# Altium project Xilinx_XCKU040_Ext_Board.PrjPcb
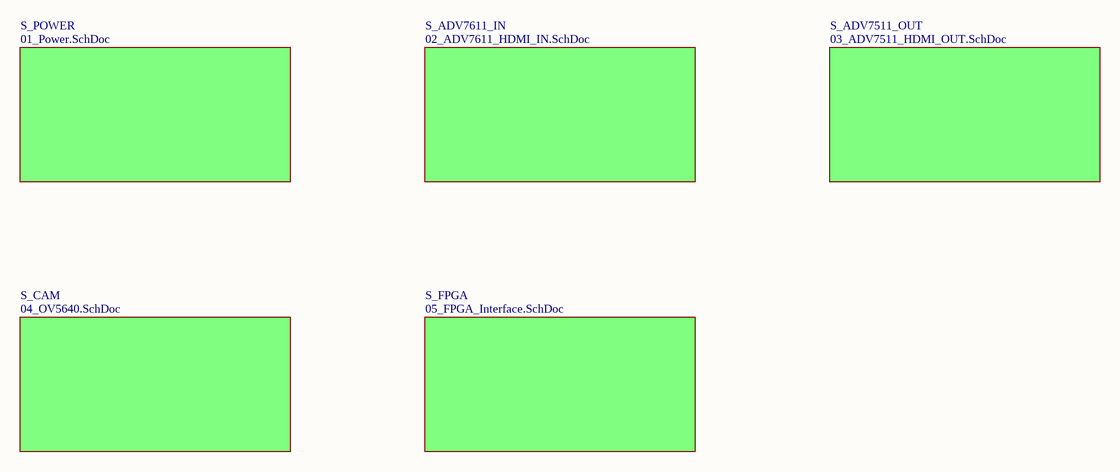
[diagram p0: 00_Top.SchDoc]
6 sheets, 134 parts. Net scope: global (net labels, ports and power ports of the same name join across sheets).
Board file: PCB1.PcbDoc
Sheets:
  00_Top.SchDoc
    S_POWER = 01_Power.SchDoc
    S_CAM = 04_OV5640.SchDoc
    S_FPGA = 05_FPGA_Interface.SchDoc
    S_ADV7611_IN = 02_ADV7611_HDMI_IN.SchDoc
    S_ADV7511_OUT = 03_ADV7511_HDMI_OUT.SchDoc

## Sheet 00_Top.SchDoc
size A3; SheetNumber: 1; SheetTotal: 6

### Sub-sheets
S_ADV7511_OUT = 03_ADV7511_HDMI_OUT.SchDoc: no entries
S_ADV7611_IN = 02_ADV7611_HDMI_IN.SchDoc: no entries
S_CAM = 04_OV5640.SchDoc: no entries
S_FPGA = 05_FPGA_Interface.SchDoc: no entries
S_POWER = 01_Power.SchDoc: no entries

## Sheet 01_Power.SchDoc
size A3; SheetNumber: 2; SheetTotal: 6
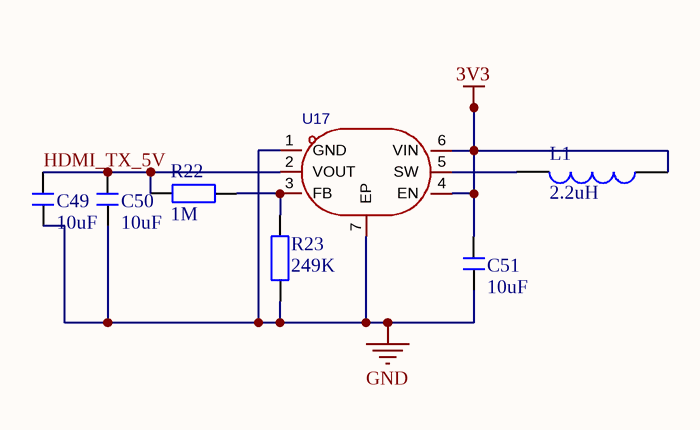
[diagram p1: 01_Power.SchDoc]

### Parts
C49  10uF  [C 0603_L]
C50  10uF  [C 0603_L]
C51  10uF  [C 0603_L]
L1  2.2uH  [L]
R22  1M  [R 0603_L]
R23  249K  [R 0603_L]
U17  tps61099drvr  [WSON-6_L2.0-W2.0-P0.65-TL-EP]  (value not drawn)

### Nets
3V3: C51.2 L1.1 U17.4(EN) U17.6(VIN)
GND: C49.1 C50.1 C51.1 R23.1 U17.1(GND) U17.7(EP)
HDMI_TX_5V: C49.2 C50.2 R22.1 U17.2(VOUT)
NetL1_2: L1.2 U17.5(SW)
NetR22_2: R22.2 R23.2 U17.3(FB)

### Library data of the parts
C49-C51 = C: 贴片电容; BOM名称: 无极性贴片电容; 淘宝ID: 封装库来自淘宝 ID：黄晶宝石; 联系售后: https://shop463601444.taobao.com
L1 = L: 小功率贴片电感; 淘宝ID: 封装库来自淘宝 ID：黄晶宝石; BOM名称: 小功率贴片电感; 联系售后: https://shop463601444.taobao.com
R22 R23 = R: 贴片电阻; 版权归属: 来自淘宝 ID：黄晶宝石; BOM名称: 贴片电阻; 联系售后: https://shop463601444.taobao.com
U17 = tps61099drvr: 功能类型:升压型;工作电压:700mV~5.5V;输出电压:1.8V~5.5V;输出电流:-;输出类型:可调;; Manufacturer: TI(德州仪器); AddInBom: yes; ModelId: 521c6d8f59ad4736925338f4a59f8ef4; ModelName: WSON-6_L2.0-W2.0-H0.8-P0.65; ModelTransform: 79.527,78.74,0,0,0,0,0,0,0; Function: 升压型; Synchronous Rectifier: 是; Number of Outputs: 1; Topology: 升压式; Quiescent Current: 1uA; Switch tube (built-in/external): 内置; Output Type: 可调; Symbol: TPS61099DRVR; LCSC Part Name: 升压型 700mV~5.5V; SupplierPart: C2842395; ManufacturerPart: TPS61099DRVR; Supplier Footprint: WSON-6-EP(2x2); JLCPCB Part Class: Extended Part; Datasheet: https://www.ti.com/cn/lit/gpn/tps61099; Supplier: LCSC; ConvertToPcb: yes; FootprintName: WSON-6_L2.0-W2.0-P0.65-TL-EP; Voltage - Supply: 700mV~5.5V; Output Voltage: 1.8V~5.5V; Output Current: -; Frequency - Switching: -; Operating Temperature: -40℃~+150℃@(TJ); Features: 轻载高效模式；逐波限流；过流保护；负载断开

## Sheet 04_OV5640.SchDoc
size A3; SheetNumber: 5; SheetTotal: 6
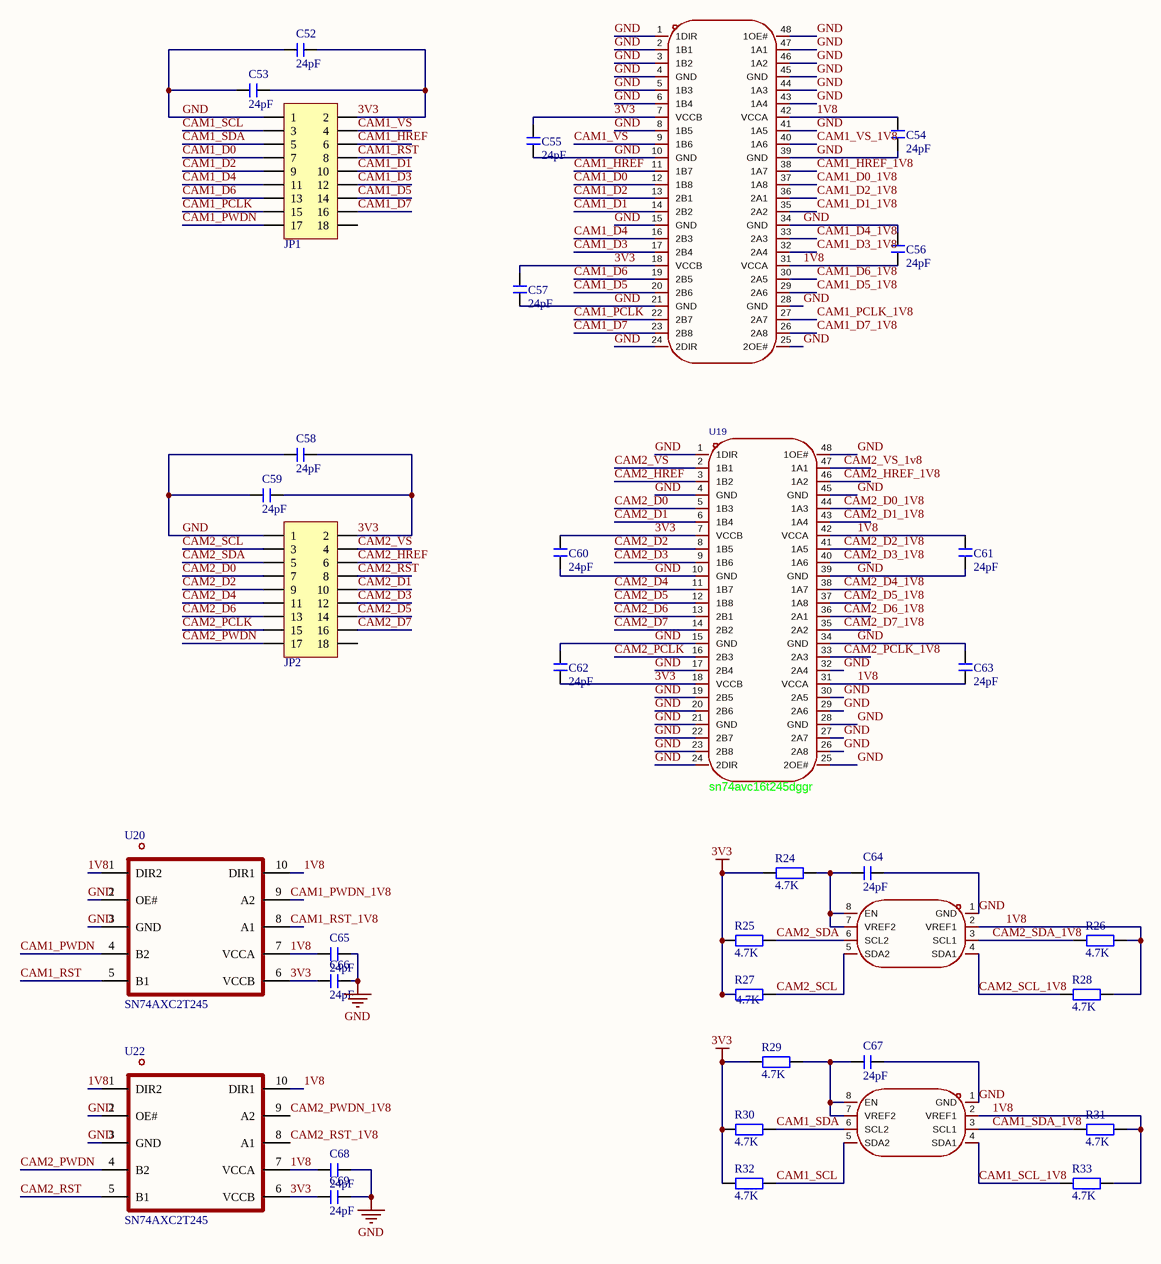
[diagram p2: 04_OV5640.SchDoc]

### Parts
C52  24pF  [C 0603_L]
C53  24pF  [C 0603_L]
C54  24pF  [C 0603_L]
C55  24pF  [C 0603_L]
C56  24pF  [C 0603_L]
C57  24pF  [C 0603_L]
C58  24pF  [C 0603_L]
C59  24pF  [C 0603_L]
C60  24pF  [C 0603_L]
C61  24pF  [C 0603_L]
C62  24pF  [C 0603_L]
C63  24pF  [C 0603_L]
C64  24pF  [C 0603_L]
C65  24pF  [C 0603_L]
C66  24pF  [C 0603_L]
C67  24pF  [C 0603_L]
C68  24pF  [C 0603_L]
C69  24pF  [C 0603_L]
JP1  Header 9X2  [HDR2.54-LI-2x9P]  (value not drawn)
JP2  Header 9X2  [HDR2.54-LI-2x9P]  (value not drawn)
R24  4.7K  [R 0603_L]
R25  4.7K  [R 0603_L]
R26  4.7K  [R 0603_L]
R27  4.7K  [R 0603_L]
R28  4.7K  [R 0603_L]
R29  4.7K  [R 0603_L]
R30  4.7K  [R 0603_L]
R31  4.7K  [R 0603_L]
R32  4.7K  [R 0603_L]
R33  4.7K  [R 0603_L]
U18  sn74avc16t245dggr  [TSSOP-48_L12.6-W6.2-P0.50-LS8.1-BL]  (value not drawn)
U19  sn74avc16t245dggr  [TSSOP-48_L12.6-W6.2-P0.50-LS8.1-BL]
U20  SN74AXC2T245  [SN74AXC2T245]
U21  pca9306dqer  [X2SON-8_L1.4-W1.0-P0.35-BL]  (value not drawn)
U22  SN74AXC2T245  [SN74AXC2T245]
U23  pca9306dqer  [X2SON-8_L1.4-W1.0-P0.35-BL]  (value not drawn)

### Nets
1V8: C54.1 C56.1 C61.1 C63.1 C65.1 C68.1 R26.1 R28.1 R31.1 R33.1 U18.31(VCCA) U18.42(VCCA) U19.31(VCCA) U19.42(VCCA) U20.1(DIR2) U20.7(VCCA) U20.10(DIR1) U21.2(VREF1) U22.1(DIR2) U22.7(VCCA) U22.10(DIR1) U23.2(VREF1)
3V3: C52.1 C53.2 C55.1 C57.1 C58.1 C59.2 C60.1 C62.2 C66.1 C69.1 JP1.2 JP2.2 R24.2 R25.2 R27.2 R29.2 R30.2 R32.2 U18.7(VCCB) U18.18(VCCB) U19.7(VCCB) U19.18(VCCB) U20.6(VCCB) U22.6(VCCB)
GND: C52.2 C53.1 C54.2 C55.2 C56.2 C57.2 C58.2 C59.1 C60.2 C61.2 C62.1 C63.2 C64.1 C65.2 C66.2 C67.1 C68.2 C69.2 JP1.1 JP2.1 U18.1(1DIR) U18.2(1B1) U18.3(1B2) U18.4(GND) U18.5(1B3) U18.6(1B4) U18.8(1B5) U18.10(GND) U18.15(GND) U18.21(GND) U18.24(2DIR) U18.25(2OE#) U18.28(GND) U18.34(GND) U18.39(GND) U18.41(1A5) U18.43(1A4) U18.44(1A3) U18.45(GND) U18.46(1A2) U18.47(1A1) U18.48(1OE#) U19.1(1DIR) U19.4(GND) U19.10(GND) U19.15(GND) U19.17(2B4) U19.19(2B5) U19.20(2B6) U19.21(GND) U19.22(2B7) U19.23(2B8) U19.24(2DIR) U19.25(2OE#) U19.26(2A8) U19.27(2A7) U19.28(GND) U19.29(2A6) U19.30(2A5) U19.32(2A4) U19.34(GND) U19.39(GND) U19.45(GND) U19.48(1OE#) U20.2(OE#) U20.3(GND) U21.1(GND) U22.2(OE#) U22.3(GND) U23.1(GND)
CAM1_D0: JP1.7 U18.12(1B8)
CAM1_D0_1V8: U18.37(1A8)
CAM1_D1: JP1.10 U18.14(2B2)
CAM1_D1_1V8: U18.35(2A2)
CAM1_D2: JP1.9 U18.13(2B1)
CAM1_D2_1V8: U18.36(2A1)
CAM1_D3: JP1.12 U18.17(2B4)
CAM1_D3_1V8: U18.32(2A4)
CAM1_D4: JP1.11 U18.16(2B3)
CAM1_D4_1V8: U18.33(2A3)
CAM1_D5: JP1.14 U18.20(2B6)
CAM1_D5_1V8: U18.29(2A6)
CAM1_D6: JP1.13 U18.19(2B5)
CAM1_D6_1V8: U18.30(2A5)
CAM1_D7: JP1.16 U18.23(2B8)
CAM1_D7_1V8: U18.26(2A8)
CAM1_HREF: JP1.6 U18.11(1B7)
CAM1_HREF_1V8: U18.38(1A7)
CAM1_PCLK: JP1.15 U18.22(2B7)
CAM1_PCLK_1V8: U18.27(2A7)
CAM1_PWDN: JP1.17 U20.4(B2)
CAM1_PWDN_1V8: U20.9(A2)
CAM1_RST: JP1.8 U20.5(B1)
CAM1_RST_1V8: U20.8(A1)
CAM1_SCL: JP1.3 R32.1 U23.5(SDA2)
CAM1_SCL_1V8: R33.2 U23.4(SDA1)
CAM1_SDA: JP1.5 R30.1 U23.6(SCL2)
CAM1_SDA_1V8: R31.2 U23.3(SCL1)
CAM1_VS: JP1.4 U18.9(1B6)
CAM1_VS_1V8: U18.40(1A6)
CAM2_D0: JP2.7 U19.5(1B3)
CAM2_D0_1V8: U19.44(1A3)
CAM2_D1: JP2.10 U19.6(1B4)
CAM2_D1_1V8: U19.43(1A4)
CAM2_D2: JP2.9 U19.8(1B5)
CAM2_D2_1V8: U19.41(1A5)
CAM2_D3: JP2.12 U19.9(1B6)
CAM2_D3_1V8: U19.40(1A6)
CAM2_D4: JP2.11 U19.11(1B7)
CAM2_D4_1V8: U19.38(1A7)
CAM2_D5: JP2.14 U19.12(1B8)
CAM2_D5_1V8: U19.37(1A8)
CAM2_D6: JP2.13 U19.13(2B1)
CAM2_D6_1V8: U19.36(2A1)
CAM2_D7: JP2.16 U19.14(2B2)
CAM2_D7_1V8: U19.35(2A2)
CAM2_HREF: JP2.6 U19.3(1B2)
CAM2_HREF_1V8: U19.46(1A2)
CAM2_PCLK: JP2.15 U19.16(2B3)
CAM2_PCLK_1V8: U19.33(2A3)
CAM2_PWDN: JP2.17 U22.4(B2)
CAM2_PWDN_1V8: U22.9(A2)
CAM2_RST: JP2.8 U22.5(B1)
CAM2_RST_1V8: U22.8(A1)
CAM2_SCL: JP2.3 R27.1 U21.5(SDA2)
CAM2_SCL_1V8: R28.2 U21.4(SDA1)
CAM2_SDA: JP2.5 R25.1 U21.6(SCL2)
CAM2_SDA_1V8: R26.2 U21.3(SCL1)
CAM2_VS: JP2.4 U19.2(1B1)
CAM2_VS_1v8: U19.47(1A1)
NetC64_2: C64.2 R24.1 U21.7(VREF2) U21.8(EN)
NetC67_2: C67.2 R29.1 U23.7(VREF2) U23.8(EN)

Not connected (* = marked no-connect by the designer): JP1 18; JP2 18

### Library data of the parts
C52-C69 = C: as C49 on sheet 01_Power; 联系售后: https://shop463601444.taobao.com
JP1 JP2 = Header 9X2: 9*2P接插件; 版权归属: 源创客; BOM名称: 9*2P接插件; 学习资源: www.ooocke.com
R24-R33 = R: 贴片电阻; 版权归属: 来自淘宝 ID：黄晶宝石; BOM名称: 贴片电阻; 联系售后: https://shop463601444.taobao.com
U18 U19 = sn74avc16t245dggr: SN74AVC16T245 具有可配置电压转换和三态输出的 16 位双电源总线收发器; Manufacturer: TI(德州仪器); AddInBom: yes; ModelId: 3630bc8bc65c4ae4913ce685d85b0283; ModelName: TSSOP-48_L12.6-W6.1-H1.0-LS8.1-P0.50; ModelTransform: 318.898,496.063,0,90,0,0,0,0.0045,0; Symbol: SN74AVC16T245DGGR; LCSC Part Name: 具备可配置电平转换/电压转换功能和三态输出的16位双电源总线收发器; SupplierPart: C148481; ManufacturerPart: SN74AVC16T245DGGR; Supplier Footprint: TSSOP-48-6.2mm; JLCPCB Part Class: Extended Part; Datasheet: https://www.ti.com/cn/lit/gpn/sn74avc16t245; Supplier: LCSC; ConvertToPcb: yes; FootprintName: TSSOP-48_L12.6-W6.2-P0.50-LS8.1-BL
U21 U23 = pca9306dqer: 数据速率:-;工作电压(VCCA):-;工作电压(VCCB):-;元件数:-;每个电路通道数:2;; Manufacturer: TI(德州仪器); AddInBom: yes; ModelId: ca9e004a924f4dd0ba6981db82d16128; ModelName: X2SON-8_L1.4-W1.0-H0.4-P0.35-BL; ModelTransform: 55.118,40.05354,0,180,0,0,0.003,0.603,0; Channel Type: 双向; Number of Circuits: 2; Output Type: 开漏; Symbol: PCA9306DQER; LCSC Part Name: 双路双向I²C总线和SMBus电压电平转换器; SupplierPart: C440032; ManufacturerPart: PCA9306DQER; Supplier Footprint: X2-SON-8(0.8x1.4); JLCPCB Part Class: Extended Part; Datasheet: https://www.ti.com/cn/lit/gpn/pca9306; Supplier: LCSC; ConvertToPcb: yes; FootprintName: X2SON-8_L1.4-W1.0-P0.35-BL; Input Signal: -; Output Signal: -; Data Rate: -; Voltage - Supply(VCCA): -; Voltage - Supply(VCCB): -; Number of Elements: -; Operating Temperature: -40℃~+85℃; Features: -

## Sheet 05_FPGA_Interface.SchDoc
size A3; SheetNumber: 6; SheetTotal: 6
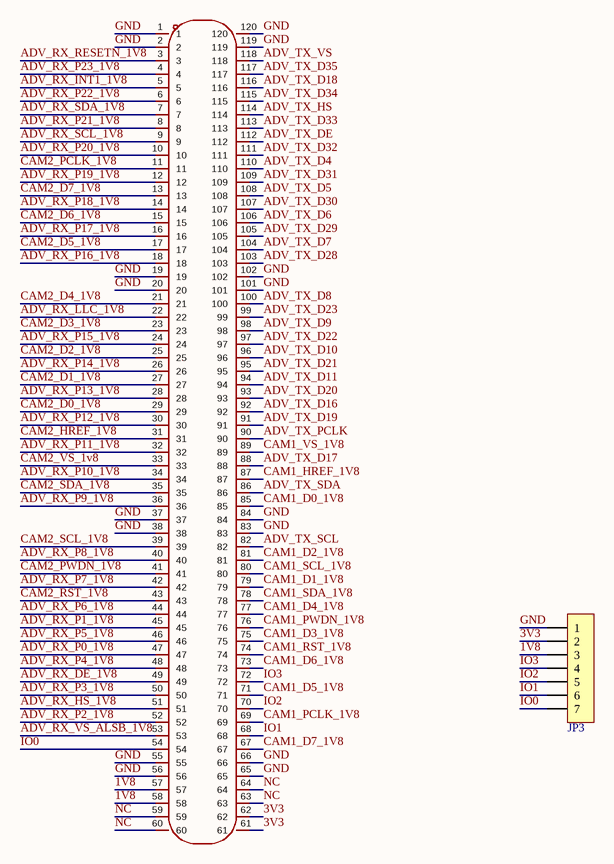
[diagram p3: 05_FPGA_Interface.SchDoc]

### Parts
CN1  xdb612-120p-cor  [CONN-SMD_120P-P0.80_THD0812F-120BV-GF]  (value not drawn)
JP3  HDR-1X7  [HDR2.54-LI-7P]  (value not drawn)

### Nets
1V8: CN1.57 CN1.58 JP3.3
3V3: CN1.61 CN1.62 JP3.2
GND: CN1.1 CN1.2 CN1.19 CN1.20 CN1.37 CN1.38 CN1.55 CN1.56 CN1.65 CN1.66 CN1.83 CN1.84 CN1.101 CN1.102 CN1.119 CN1.120 JP3.1
ADV_RX_DE_1V8: CN1.49
ADV_RX_HS_1V8: CN1.51
ADV_RX_INT1_1V8: CN1.5
ADV_RX_LLC_1V8: CN1.22
ADV_RX_P0_1V8: CN1.47
ADV_RX_P1_1V8: CN1.45
ADV_RX_P2_1V8: CN1.52
ADV_RX_P3_1V8: CN1.50
ADV_RX_P4_1V8: CN1.48
ADV_RX_P5_1V8: CN1.46
ADV_RX_P6_1V8: CN1.44
ADV_RX_P7_1V8: CN1.42
ADV_RX_P8_1V8: CN1.40
ADV_RX_P9_1V8: CN1.36
ADV_RX_P10_1V8: CN1.34
ADV_RX_P11_1V8: CN1.32
ADV_RX_P12_1V8: CN1.30
ADV_RX_P13_1V8: CN1.28
ADV_RX_P14_1V8: CN1.26
ADV_RX_P15_1V8: CN1.24
ADV_RX_P16_1V8: CN1.18
ADV_RX_P17_1V8: CN1.16
ADV_RX_P18_1V8: CN1.14
ADV_RX_P19_1V8: CN1.12
ADV_RX_P20_1V8: CN1.10
ADV_RX_P21_1V8: CN1.8
ADV_RX_P22_1V8: CN1.6
ADV_RX_P23_1V8: CN1.4
ADV_RX_RESETN_1V8: CN1.3
ADV_RX_SCL_1V8: CN1.9
ADV_RX_SDA_1V8: CN1.7
ADV_RX_VS_ALSB_1V8: CN1.53
ADV_TX_D4: CN1.110
ADV_TX_D5: CN1.108
ADV_TX_D6: CN1.106
ADV_TX_D7: CN1.104
ADV_TX_D8: CN1.100
ADV_TX_D9: CN1.98
ADV_TX_D10: CN1.96
ADV_TX_D11: CN1.94
ADV_TX_D16: CN1.92
ADV_TX_D17: CN1.88
ADV_TX_D18: CN1.116
ADV_TX_D19: CN1.91
ADV_TX_D20: CN1.93
ADV_TX_D21: CN1.95
ADV_TX_D22: CN1.97
ADV_TX_D23: CN1.99
ADV_TX_D28: CN1.103
ADV_TX_D29: CN1.105
ADV_TX_D30: CN1.107
ADV_TX_D31: CN1.109
ADV_TX_D32: CN1.111
ADV_TX_D33: CN1.113
ADV_TX_D34: CN1.115
ADV_TX_D35: CN1.117
ADV_TX_DE: CN1.112
ADV_TX_HS: CN1.114
ADV_TX_PCLK: CN1.90
ADV_TX_SCL: CN1.82
ADV_TX_SDA: CN1.86
ADV_TX_VS: CN1.118
CAM1_D0_1V8: CN1.85
CAM1_D1_1V8: CN1.79
CAM1_D2_1V8: CN1.81
CAM1_D3_1V8: CN1.75
CAM1_D4_1V8: CN1.77
CAM1_D5_1V8: CN1.71
CAM1_D6_1V8: CN1.73
CAM1_D7_1V8: CN1.67
CAM1_HREF_1V8: CN1.87
CAM1_PCLK_1V8: CN1.69
CAM1_PWDN_1V8: CN1.76
CAM1_RST_1V8: CN1.74
CAM1_SCL_1V8: CN1.80
CAM1_SDA_1V8: CN1.78
CAM1_VS_1V8: CN1.89
CAM2_D0_1V8: CN1.29
CAM2_D1_1V8: CN1.27
CAM2_D2_1V8: CN1.25
CAM2_D3_1V8: CN1.23
CAM2_D4_1V8: CN1.21
CAM2_D5_1V8: CN1.17
CAM2_D6_1V8: CN1.15
CAM2_D7_1V8: CN1.13
CAM2_HREF_1V8: CN1.31
CAM2_PCLK_1V8: CN1.11
CAM2_PWDN_1V8: CN1.41
CAM2_RST_1V8: CN1.43
CAM2_SCL_1V8: CN1.39
CAM2_SDA_1V8: CN1.35
CAM2_VS_1v8: CN1.33
IO0: CN1.54 JP3.7
IO1: CN1.68 JP3.6
IO2: CN1.70 JP3.5
IO3: CN1.72 JP3.4
NC: CN1.59 CN1.60 CN1.63 CN1.64

### Library data of the parts
CN1 = xdb612-120p-cor: PIN总数:120P;间距:0.8mm;安装方式:立贴;排数:2;额定电流:500mA;工作温度:-45℃~+80℃;; Manufacturer: LX(连欣科技); AddInBom: yes; ModelId: 534587499f204ed784a0d3d633a8bbcf; ModelTransform: 2118.10616,236.22,0,0,0,0,0.002,0,-27.559; Pitch: 0.8mm; Current Rating: 500mA; Symbol: XDB612-120P-COR; LCSC Part Name: AMP宏致同款BTB板对板PH0.8-2*60P/120PIN母座 合高5.0MM; SupplierPart: C7527742; ManufacturerPart: XDB612-120P-COR; Supplier Footprint: SMD,P=0.8mm; JLCPCB Part Class: Extended Part; Datasheet: https://item.szlcsc.com/datasheet/XDB612-120P-COR/8623463.html; Supplier: LCSC; ConvertToPcb: yes; FootprintName: CONN-SMD_120P-P0.80_THD0812F-120BV-GF; ModelName: CONN-SMD_120P-P0.80_THD0812F-120BV-GF; Number of Pins: 120P; Mounting Type: 立贴; Number of Rows: 2; Contact Material: 铜; Contact Plating: 金; Operating Temperature: -45℃~+80℃
JP3 = Header 7: 7P接插件; 版权归属: 封装库来自淘宝 ID：黄晶宝石; BOM名称: 7P接插件; 学习资源: https://shop463601444.taobao.com

## Sheet 02_ADV7611_HDMI_IN.SchDoc
size A3; SheetNumber: 3; SheetTotal: 6
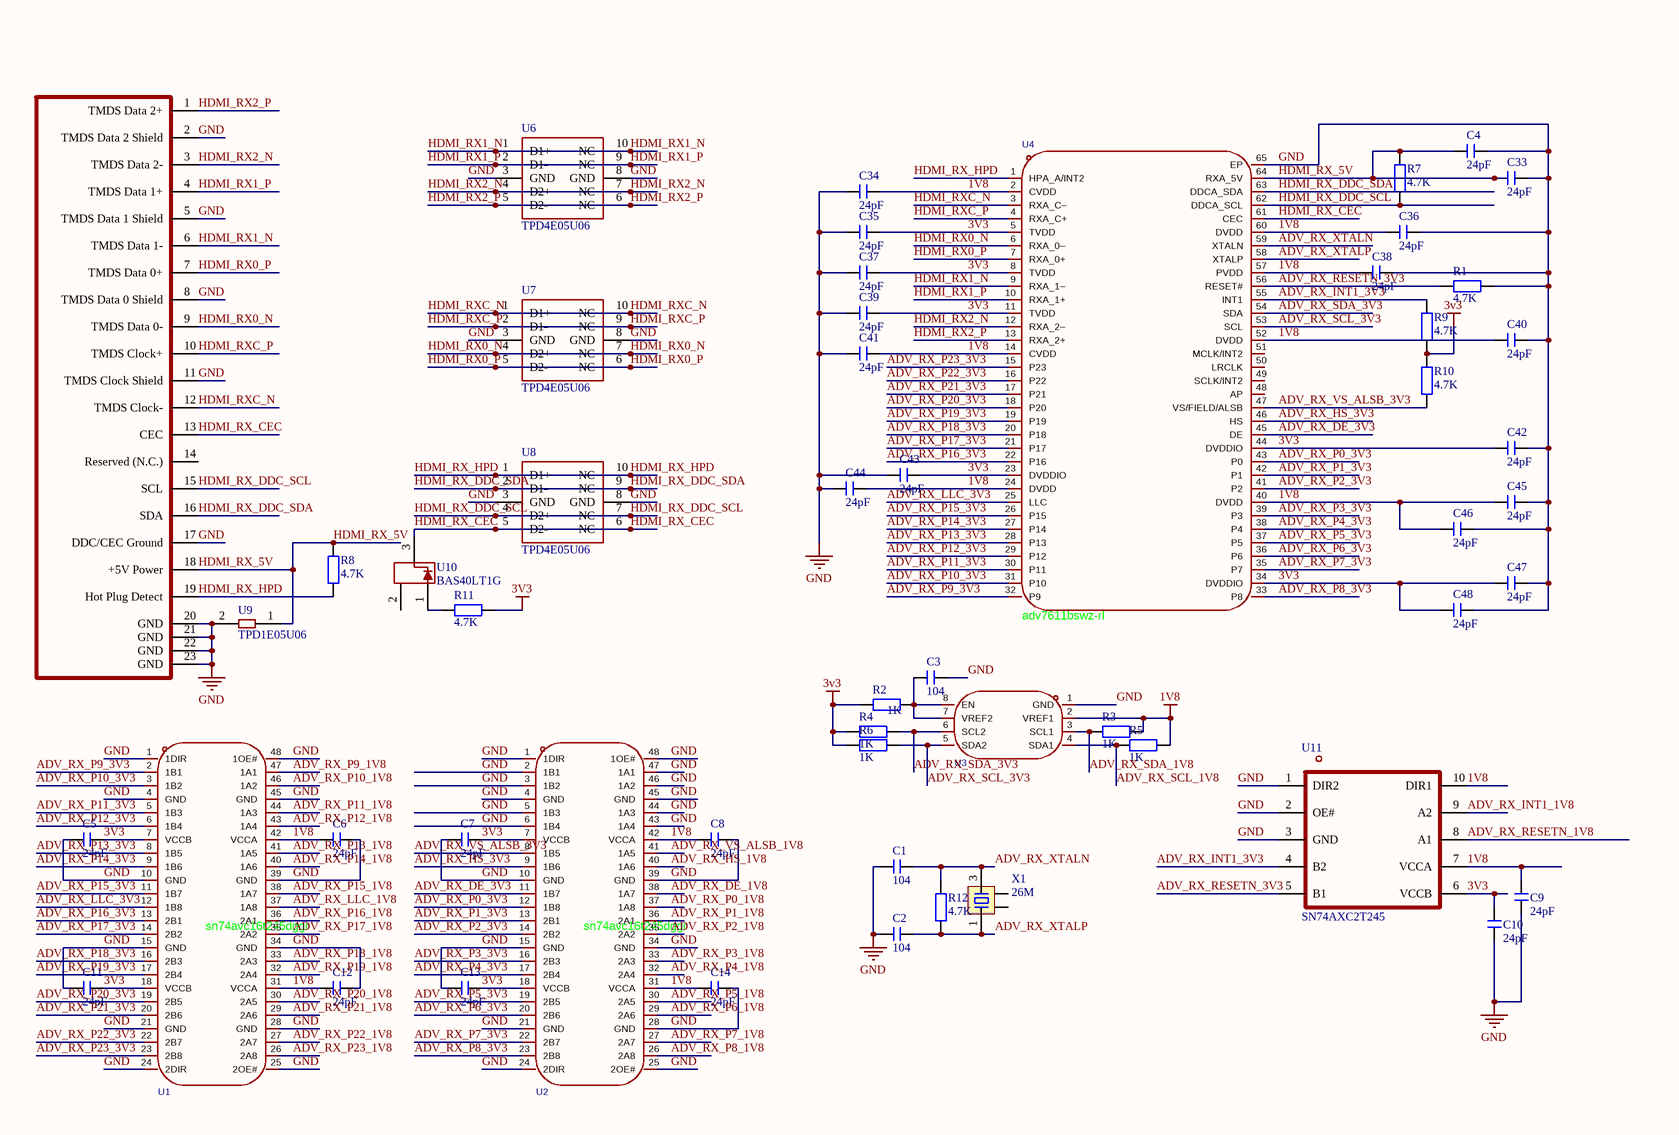
[diagram p4: 02_ADV7611_HDMI_IN.SchDoc, left]

### Parts
C1  104  [C 0603_L]
C2  104  [C 0603_L]
C3  104  [C 0603_L]
C4  24pF  [C 0603_L]
C5  24pF  [C 0603_L]
C6  24pF  [C 0603_L]
C7  24pF  [C 0603_L]
C8  24pF  [C 0603_L]
C9  24pF  [C 0603_L]
C10  24pF  [C 0603_L]
C11  24pF  [C 0603_L]
C12  24pF  [C 0603_L]
C13  24pF  [C 0603_L]
C14  24pF  [C 0603_L]
C33  24pF  [C 0603_L]
C34  24pF  [C 0603_L]
C35  24pF  [C 0603_L]
C36  24pF  [C 0603_L]
C37  24pF  [C 0603_L]
C38  24pF  [C 0603_L]
C39  24pF  [C 0603_L]
C40  24pF  [C 0603_L]
C41  24pF  [C 0603_L]
C42  24pF  [C 0603_L]
C43  24pF  [C 0603_L]
C44  24pF  [C 0603_L]
C45  24pF  [C 0603_L]
C46  24pF  [C 0603_L]
C47  24pF  [C 0603_L]
C48  24pF  [C 0603_L]
R1  4.7K  [R 0603_L]
R2  1K  [R 0603_L]
R3  1K  [R 0603_L]
R4  1K  [R 0603_L]
R5  1K  [R 0603_L]
R6  1K  [R 0603_L]
R7  4.7K  [R 0603_L]
R8  4.7K  [R 0603_L]
R9  4.7K  [R 0603_L]
R10  4.7K  [R 0603_L]
R11  4.7K  [R 0603_L]
R12  4.7K  [R 0603_L]
U1  sn74avc16t245dggr  [TSSOP-48_L12.6-W6.2-P0.50-LS8.1-BL]
U2  sn74avc16t245dggr  [TSSOP-48_L12.6-W6.2-P0.50-LS8.1-BL]
U3  pca9306dqer  [X2SON-8_L1.4-W1.0-P0.35-BL]  (value not drawn)
U4  adv7611bswz-rl  [LQFP-64_L10.0-W10.0-P0.50-LS12.0-TL-EP5.3]
U6  TPD4E05U06  [TPD4E05U06DQAR]
U7  TPD4E05U06  [TPD4E05U06DQAR]
U8  TPD4E05U06  [TPD4E05U06DQAR]
U9  TPD1E05U06  [TPD1E05U06]
U10  BAS40LT1G  [BAS40LT1G]
U11  SN74AXC2T245  [SN74AXC2T245]
USB1  hdmi-001s  [HDMI-SMD_HDMI-001S]  (value not drawn)
X1  26M  [OSC 1612-4P]

### Nets
1V8: C6.1 C8.1 C9.2 C12.1 C14.1 C34.2 C36.1 C38.1 C40.1 C41.2 C44.2 C45.1 C46.1 R3.2 R5.2 U1.31(VCCA) U1.42(VCCA) U2.31(VCCA) U2.42(VCCA) U3.2(VREF1) U4.2(CVDD) U4.14(CVDD) U4.24(DVDD) U4.40(DVDD) U4.52(DVDD) U4.57(PVDD) U4.60(DVDD) U11.7(VCCA) U11.10(DIR1)
3V3: C5.2 C7.2 C10.2 C11.2 C13.2 C35.2 C37.2 C39.2 C42.1 C43.2 C47.1 C48.1 R2.2 R4.1 R6.1 R9.2 R10.1 R11.2 U1.7(VCCB) U1.18(VCCB) U2.7(VCCB) U2.18(VCCB) U4.5(TVDD) U4.8(TVDD) U4.11(TVDD) U4.23(DVDDIO) U4.34(DVDDIO) U4.44(DVDDIO) U11.6(VCCB)
GND: C1.1 C2.1 C3.2 C4.2 C5.1 C6.2 C7.1 C8.2 C9.1 C10.1 C11.1 C12.2 C13.1 C14.2 C33.2 C34.1 C35.1 C36.2 C37.1 C38.2 C39.1 C40.2 C41.1 C42.2 C43.1 C44.1 C45.2 C46.2 C47.2 C48.2 R1.2 U1.1(1DIR) U1.4(GND) U1.10(GND) U1.15(GND) U1.21(GND) U1.24(2DIR) U1.25(2OE#) U1.28(GND) U1.34(GND) U1.39(GND) U1.45(GND) U1.48(1OE#) U2.1(1DIR) U2.2(1B1) U2.3(1B2) U2.4(GND) U2.5(1B3) U2.6(1B4) U2.10(GND) U2.15(GND) U2.21(GND) U2.24(2DIR) U2.25(2OE#) U2.28(GND) U2.34(GND) U2.39(GND) U2.43(1A4) U2.44(1A3) U2.45(GND) U2.46(1A2) U2.47(1A1) U2.48(1OE#) U3.1(GND) U4.65(EP) U6.3(GND) U6.8(GND) U7.3(GND) U7.8(GND) U8.3(GND) U8.8(GND) U9.2(GND) U11.1(DIR2) U11.2(OE#) U11.3(GND) USB1.2(TMDS_Data_2_Shield) USB1.5(TMDS_Data_1_Shield) USB1.8(TMDS_Data_0_Shield) USB1.11(TMDS_Clock_Shield) USB1.17(DDC/CEC_Ground) USB1.20(GND) USB1.21(GND) USB1.22(GND) USB1.23(GND)
ADV_RX_DE_1V8: U2.38(1A7)
ADV_RX_DE_3V3: U2.11(1B7) U4.45(DE)
ADV_RX_HS_1V8: U2.40(1A6)
ADV_RX_HS_3V3: U2.9(1B6) U4.46(HS)
ADV_RX_INT1_1V8: U11.9(A2)
ADV_RX_INT1_3V3: R9.1 U4.55(INT1) U11.4(B2)
ADV_RX_LLC_1V8: U1.37(1A8)
ADV_RX_LLC_3V3: U1.12(1B8) U4.25(LLC)
ADV_RX_P0_1V8: U2.37(1A8)
ADV_RX_P0_3V3: U2.12(1B8) U4.43(P0)
ADV_RX_P1_1V8: U2.36(2A1)
ADV_RX_P1_3V3: U2.13(2B1) U4.42(P1)
ADV_RX_P2_1V8: U2.35(2A2)
ADV_RX_P2_3V3: U2.14(2B2) U4.41(P2)
ADV_RX_P3_1V8: U2.33(2A3)
ADV_RX_P3_3V3: U2.16(2B3) U4.39(P3)
ADV_RX_P4_1V8: U2.32(2A4)
ADV_RX_P4_3V3: U2.17(2B4) U4.38(P4)
ADV_RX_P5_1V8: U2.30(2A5)
ADV_RX_P5_3V3: U2.19(2B5) U4.37(P5)
ADV_RX_P6_1V8: U2.29(2A6)
ADV_RX_P6_3V3: U2.20(2B6) U4.36(P6)
ADV_RX_P7_1V8: U2.27(2A7)
ADV_RX_P7_3V3: U2.22(2B7) U4.35(P7)
ADV_RX_P8_1V8: U2.26(2A8)
ADV_RX_P8_3V3: U2.23(2B8) U4.33(P8)
ADV_RX_P9_1V8: U1.47(1A1)
ADV_RX_P9_3V3: U1.2(1B1) U4.32(P9)
ADV_RX_P10_1V8: U1.46(1A2)
ADV_RX_P10_3V3: U1.3(1B2) U4.31(P10)
ADV_RX_P11_1V8: U1.44(1A3)
ADV_RX_P11_3V3: U1.5(1B3) U4.30(P11)
ADV_RX_P12_1V8: U1.43(1A4)
ADV_RX_P12_3V3: U1.6(1B4) U4.29(P12)
ADV_RX_P13_1V8: U1.41(1A5)
ADV_RX_P13_3V3: U1.8(1B5) U4.28(P13)
ADV_RX_P14_1V8: U1.40(1A6)
ADV_RX_P14_3V3: U1.9(1B6) U4.27(P14)
ADV_RX_P15_1V8: U1.38(1A7)
ADV_RX_P15_3V3: U1.11(1B7) U4.26(P15)
ADV_RX_P16_1V8: U1.36(2A1)
ADV_RX_P16_3V3: U1.13(2B1) U4.22(P16)
ADV_RX_P17_1V8: U1.35(2A2)
ADV_RX_P17_3V3: U1.14(2B2) U4.21(P17)
ADV_RX_P18_1V8: U1.33(2A3)
ADV_RX_P18_3V3: U1.16(2B3) U4.20(P18)
ADV_RX_P19_1V8: U1.32(2A4)
ADV_RX_P19_3V3: U1.17(2B4) U4.19(P19)
ADV_RX_P20_1V8: U1.30(2A5)
ADV_RX_P20_3V3: U1.19(2B5) U4.18(P20)
ADV_RX_P21_1V8: U1.29(2A6)
ADV_RX_P21_3V3: U1.20(2B6) U4.17(P21)
ADV_RX_P22_1V8: U1.27(2A7)
ADV_RX_P22_3V3: U1.22(2B7) U4.16(P22)
ADV_RX_P23_1V8: U1.26(2A8)
ADV_RX_P23_3V3: U1.23(2B8) U4.15(P23)
ADV_RX_RESETN_1V8: U11.8(A1)
ADV_RX_RESETN_3V3: R1.1 U4.56(RESET#) U11.5(B1)
ADV_RX_SCL_1V8: R5.1 U3.4(SDA1)
ADV_RX_SCL_3V3: R6.2 U3.5(SDA2) U4.53(SCL)
ADV_RX_SDA_1V8: R3.1 U3.3(SCL1)
ADV_RX_SDA_3V3: R4.2 U3.6(SCL2) U4.54(SDA)
ADV_RX_VS_ALSB_1V8: U2.41(1A5)
ADV_RX_VS_ALSB_3V3: R10.2 U2.8(1B5) U4.47(VS/FIELD/ALSB)
ADV_RX_XTALN: C1.2 R12.2 U4.59(XTALN) X1.3
ADV_RX_XTALP: C2.2 R12.1 U4.58(XTALP) X1.1
HDMI_RX0_N: U4.6(RXA_0–) U7.4(D2+) U7.7(NC) USB1.9(TMDS_Data_0-)
HDMI_RX0_P: U4.7(RXA_0+) U7.5(D2-) U7.6(NC) USB1.7(TMDS_Data_0+)
HDMI_RX1_N: U4.9(RXA_1–) U6.1(D1+) U6.10(NC) USB1.6(TMDS_Data_1-)
HDMI_RX1_P: U4.10(RXA_1+) U6.2(D1-) U6.9(NC) USB1.4(TMDS_Data_1+)
HDMI_RX2_N: U4.12(RXA_2–) U6.4(D2+) U6.7(NC) USB1.3(TMDS_Data_2-)
HDMI_RX2_P: U4.13(RXA_2+) U6.5(D2-) U6.6(NC) USB1.1(TMDS_Data_2+)
HDMI_RX_5V: C4.1 C33.1 R7.2 R8.1 U4.64(RXA_5V) U9.1(IO) USB1.18(+5V_Power)
HDMI_RX_CEC: U4.61(CEC) U8.5(D2-) U8.6(NC) U10.3 USB1.13(CEC)
HDMI_RX_DDC_SCL: R7.1 U4.62(DDCA_SCL) U8.4(D2+) U8.7(NC) USB1.15(SCL)
HDMI_RX_DDC_SDA: U4.63(DDCA_SDA) U8.2(D1-) U8.9(NC) USB1.16(SDA)
HDMI_RX_HPD: R8.2 U4.1(HPA_A/INT2) U8.1(D1+) U8.10(NC) USB1.19(Hot_Plug_Detect)
HDMI_RXC_N: U4.3(RXA_C–) U7.1(D1+) U7.10(NC) USB1.12(TMDS_Clock-)
HDMI_RXC_P: U4.4(RXA_C+) U7.2(D1-) U7.9(NC) USB1.10(TMDS_Clock+)
NetC3_1: C3.1 R2.1 U3.7(VREF2) U3.8(EN)
NetR11_1: R11.1 U10.1

Not connected (* = marked no-connect by the designer): U4 48(AP) 49(SCLK/INT2) 50(LRCLK) 51(MCLK/INT2); U10 2; USB1 14(Reserved_(N.C.)); X1 2 4

### Library data of the parts
C1-C14 C33-C48 = C: as C49 on sheet 01_Power; 联系售后: https://shop463601444.taobao.com
R1-R12 = R: 贴片电阻; 版权归属: 来自淘宝 ID：黄晶宝石; BOM名称: 贴片电阻; 联系售后: https://shop463601444.taobao.com
U1 U2 = sn74avc16t245dggr: as U18 on sheet 04_OV5640; Symbol: SN74AVC16T245DGGR; LCSC Part Name: 具备可配置电平转换/电压转换功能和三态输出的16位双电源总线收发器; SupplierPart: C148481; ManufacturerPart: SN74AVC16T245DGGR; Supplier Footprint: TSSOP-48-6.2mm; JLCPCB Part Class: Extended Part; Datasheet: https://www.ti.com/cn/lit/gpn/sn74avc16t245; Supplier: LCSC; ConvertToPcb: yes; FootprintName: TSSOP-48_L12.6-W6.2-P0.50-LS8.1-BL
U3 = pca9306dqer: as U21 on sheet 04_OV5640; Symbol: PCA9306DQER; LCSC Part Name: 双路双向I²C总线和SMBus电压电平转换器; SupplierPart: C440032; ManufacturerPart: PCA9306DQER; Supplier Footprint: X2-SON-8(0.8x1.4); JLCPCB Part Class: Extended Part; Datasheet: https://www.ti.com/cn/lit/gpn/pca9306; Supplier: LCSC; ConvertToPcb: yes; FootprintName: X2SON-8_L1.4-W1.0-P0.35-BL; Input Signal: -; Output Signal: -; Data Rate: -; Voltage - Supply(VCCA): -; Voltage - Supply(VCCB): -; Number of Elements: -; Operating Temperature: -40℃~+85℃; Features: -
U4 = adv7611bswz-rl: ADV7611提供汽车级、专业级(无HDCP)和工业级三种版本，工作温度范围为 -40 °C 至 +85 °C。是一款高质量、单输入HDMI接收器，内置HDMI兼容型接收器，支持HDMI 1.4a规定的所有强制性3D电视格式，和最高UXGA 60 Hz、8位的分辨率。它集成一个CEC控制器，支持CDC特性。具有一个音频输出端口，用于输出从HDMI流提取的音频数据。HDMI接收器具有高级静音控制器，可消除音频输出中的外来声频噪声。支持来自I2S串行器的音频流(两个音频通道)、来自S/PDIF串行器的音频流(; Manufacturer: ADI(亚德诺); AddInBom: yes; ModelId: cd9de06618c44fcf82654c43a457f83c; ModelName: LQFP-64_L10.0-W10.0-H1.4-LS12.0-P0.50; ModelTransform: 472.441,472.441,0,270,0,0,0,0,0; Symbol: ADV7611BSWZ-RL; LCSC Part Name: 低功耗165 MHz HDMI接收器; SupplierPart: C706706; ManufacturerPart: ADV7611BSWZ-RL; Supplier Footprint: LQFP-64(10x10); JLCPCB Part Class: Extended Part; Datasheet: https://item.szlcsc.com/datasheet/ADV7611BSWZ-RL/743801.html; Supplier: LCSC; ConvertToPcb: yes; FootprintName: LQFP-64_L10.0-W10.0-P0.50-LS12.0-TL-EP5.3
U6-U8 = TPD4E05U06: TVS 5V ESD
U9 = TPD1E05U06: 单通道ESD
U10 = BAS40LT1G: 肖特基二极管
USB1 = hdmi-001s: 19PIN A型前插后贴HDMI插座 铜壳; Manufacturer: XUNPU(讯普); AddInBom: yes; ModelId: 95350f9f774e4f059b8c605506db97f9; ModelTransform: 590.5878,468.503,0,0,0,0,0,-79.567,-85.039; Connector Type: HDMI-A; Gender: 母; Symbol: HDMI-001S; LCSC Part Name: HDMI-A 母 19P; SupplierPart: C720616; ManufacturerPart: HDMI-001S; Supplier Footprint: SMD; JLCPCB Part Class: Extended Part; Datasheet: https://item.szlcsc.com/datasheet/HDMI-001S/763623.html; Supplier: LCSC; ConvertToPcb: yes; FootprintName: HDMI-SMD_HDMI-001S; ModelName: HDMI-SMD_HDMI-001S; Number of Pins: 19P; Mounting Type: 卧贴; Current Rating: -; Voltage Rating: -; Operating Temperature: -
X1 = XTAL-4P: 4脚无源晶振; 版权归属: 源创客; BOM名称: 4脚无源晶振; 学习资源: www.ooocke.com

## Sheet 03_ADV7511_HDMI_OUT.SchDoc
size A3; SheetNumber: 4; SheetTotal: 6
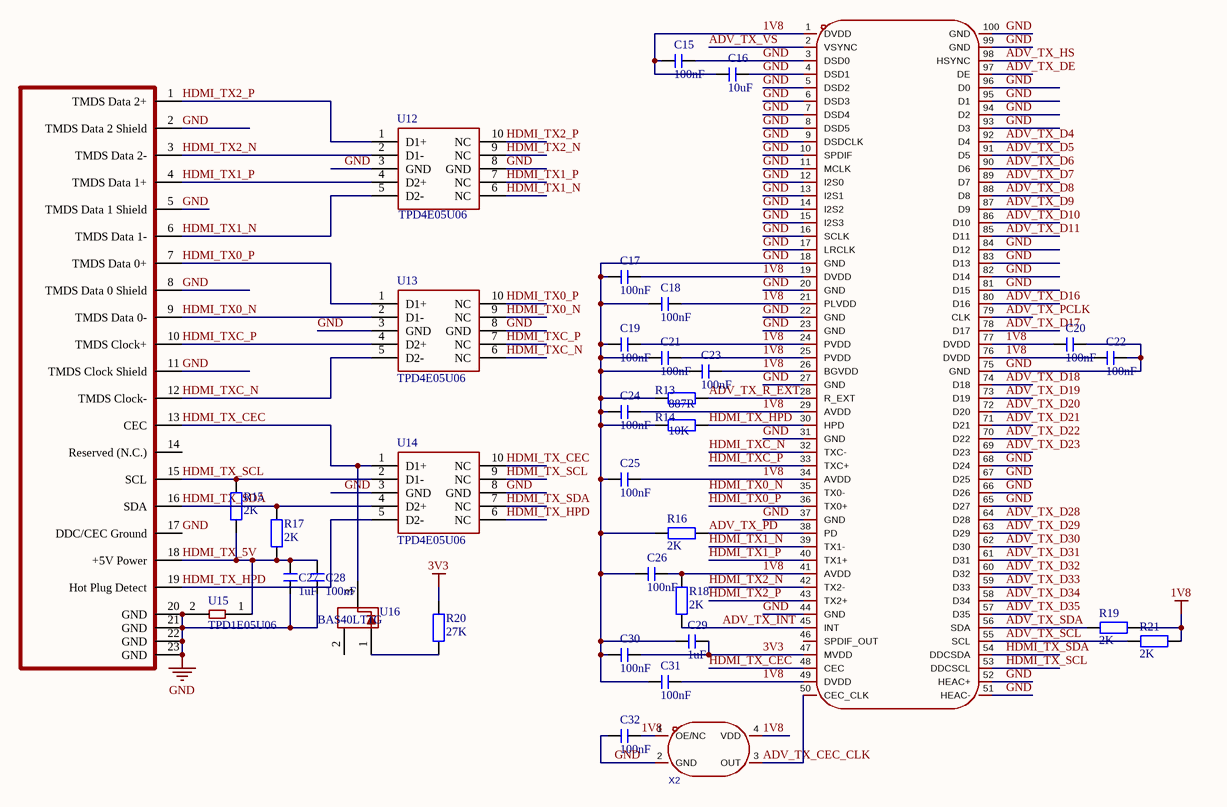
[diagram p5: 03_ADV7511_HDMI_OUT.SchDoc]

### Parts
C15  100nF  [C 0603_L]
C16  10uF  [C 0603_L]
C17  100nF  [C 0603_L]
C18  100nF  [C 0603_L]
C19  100nF  [C 0603_L]
C20  100nF  [C 0603_L]
C21  100nF  [C 0603_L]
C22  100nF  [C 0603_L]
C23  100nF  [C 0603_L]
C24  100nF  [C 0603_L]
C25  100nF  [C 0603_L]
C26  100nF  [C 0603_L]
C27  1uF  [C 0603_L]
C28  100nF  [C 0603_L]
C29  1uF  [C 0603_L]
C30  100nF  [C 0603_L]
C31  100nF  [C 0603_L]
C32  100nF  [C 0603_L]
R13  887R  [R 0603_L]
R14  10K  [R 0603_L]
R15  2K  [R 0603_L]
R16  2K  [R 0603_L]
R17  2K  [R 0603_L]
R18  2K  [R 0603_L]
R19  2K  [R 0603_L]
R20  27K  [R 0603_L]
R21  2K  [R 0603_L]
U5  adv7511kstz  [LQFP-100_L14.0-W14.0-P0.50-LS16.0-BL]  (value not drawn)
U12  TPD4E05U06  [TPD4E05U06DQAR]
U13  TPD4E05U06  [TPD4E05U06DQAR]
U14  TPD4E05U06  [TPD4E05U06DQAR]
U15  TPD1E05U06  [TPD1E05U06]
U16  BAS40LT1G  [BAS40LT1G]
USB3  hdmi-001s  [HDMI-SMD_HDMI-001S]  (value not drawn)
X2  ot322512mjba4sl  [OSC-SMD_4P-L3.2-W2.5-BL]  (value not drawn)

### Nets
1V8: C15.2 C16.2 C17.1 C18.1 C19.1 C20.2 C21.1 C22.2 C23.1 C24.1 C25.1 C26.1 C31.1 C32.1 R18.1 R19.2 R21.2 U5.1(DVDD) U5.19(DVDD) U5.21(PLVDD) U5.24(PVDD) U5.25(PVDD) U5.26(BGVDD) U5.29(AVDD) U5.34(AVDD) U5.41(AVDD) U5.49(DVDD) U5.76(DVDD) U5.77(DVDD) X2.1(OE/NC) X2.4(VDD)
3V3: C29.1 C30.1 R20.2 U5.47(MVDD)
GND: C15.1 C16.1 C17.2 C18.2 C19.2 C20.1 C21.2 C22.1 C23.2 C24.2 C25.2 C26.2 C27.2 C28.2 C29.2 C30.2 C31.2 C32.2 R13.1 R14.1 R16.1 U5.3(DSD0) U5.4(DSD1) U5.5(DSD2) U5.6(DSD3) U5.7(DSD4) U5.8(DSD5) U5.9(DSDCLK) U5.10(SPDIF) U5.11(MCLK) U5.12(I2S0) U5.13(I2S1) U5.14(I2S2) U5.15(I2S3) U5.16(SCLK) U5.17(LRCLK) U5.18(GND) U5.20(GND) U5.22(GND) U5.23(GND) U5.27(GND) U5.31(GND) U5.37(GND) U5.44(GND) U5.51(HEAC-) U5.52(HEAC+) U5.65(D27) U5.66(D26) U5.67(D25) U5.68(D24) U5.75(GND) U5.81(D15) U5.82(D14) U5.83(D13) U5.84(D12) U5.93(D3) U5.94(D2) U5.95(D1) U5.96(D0) U5.99(GND) U5.100(GND) U12.3(GND) U12.8(GND) U13.3(GND) U13.8(GND) U14.3(GND) U14.8(GND) U15.2(GND) USB3.2(TMDS_Data_2_Shield) USB3.5(TMDS_Data_1_Shield) USB3.8(TMDS_Data_0_Shield) USB3.11(TMDS_Clock_Shield) USB3.17(DDC/CEC_Ground) USB3.20(GND) USB3.21(GND) USB3.22(GND) USB3.23(GND) X2.2(GND)
ADV_TX_CEC_CLK: U5.50(CEC_CLK) X2.3(OUT)
ADV_TX_D4: U5.92(D4)
ADV_TX_D5: U5.91(D5)
ADV_TX_D6: U5.90(D6)
ADV_TX_D7: U5.89(D7)
ADV_TX_D8: U5.88(D8)
ADV_TX_D9: U5.87(D9)
ADV_TX_D10: U5.86(D10)
ADV_TX_D11: U5.85(D11)
ADV_TX_D16: U5.80(D16)
ADV_TX_D17: U5.78(D17)
ADV_TX_D18: U5.74(D18)
ADV_TX_D19: U5.73(D19)
ADV_TX_D20: U5.72(D20)
ADV_TX_D21: U5.71(D21)
ADV_TX_D22: U5.70(D22)
ADV_TX_D23: U5.69(D23)
ADV_TX_D28: U5.64(D28)
ADV_TX_D29: U5.63(D29)
ADV_TX_D30: U5.62(D30)
ADV_TX_D31: U5.61(D31)
ADV_TX_D32: U5.60(D32)
ADV_TX_D33: U5.59(D33)
ADV_TX_D34: U5.58(D34)
ADV_TX_D35: U5.57(D35)
ADV_TX_DE: U5.97(DE)
ADV_TX_HS: U5.98(HSYNC)
ADV_TX_INT: R18.2 U5.45(INT)
ADV_TX_PCLK: U5.79(CLK)
ADV_TX_PD: R16.2 U5.38(PD)
ADV_TX_R_EXT: R13.2 U5.28(R_EXT)
ADV_TX_SCL: R21.1 U5.55(SCL)
ADV_TX_SDA: R19.1 U5.56(SDA)
ADV_TX_VS: U5.2(VSYNC)
HDMI_TX0_N: U5.35(TX0-) U13.2(D1-) U13.9(NC) USB3.9(TMDS_Data_0-)
HDMI_TX0_P: U5.36(TX0+) U13.1(D1+) U13.10(NC) USB3.7(TMDS_Data_0+)
HDMI_TX1_N: U5.39(TX1-) U12.5(D2-) U12.6(NC) USB3.6(TMDS_Data_1-)
HDMI_TX1_P: U5.40(TX1+) U12.4(D2+) U12.7(NC) USB3.4(TMDS_Data_1+)
HDMI_TX2_N: U5.42(TX2-) U12.2(D1-) U12.9(NC) USB3.3(TMDS_Data_2-)
HDMI_TX2_P: U5.43(TX2+) U12.1(D1+) U12.10(NC) USB3.1(TMDS_Data_2+)
HDMI_TX_5V: C27.1 C28.1 R15.1 R17.1 U15.1(IO) USB3.18(+5V_Power)
HDMI_TX_CEC: U5.48(CEC) U14.1(D1+) U14.10(NC) U16.3 USB3.13(CEC)
HDMI_TX_HPD: R14.2 U5.30(HPD) U14.5(D2-) U14.6(NC) USB3.19(Hot_Plug_Detect)
HDMI_TX_SCL: R15.2 U5.53(DDCSCL) U14.2(D1-) U14.9(NC) USB3.15(SCL)
HDMI_TX_SDA: R17.2 U5.54(DDCSDA) U14.4(D2+) U14.7(NC) USB3.16(SDA)
HDMI_TXC_N: U5.32(TXC-) U13.5(D2-) U13.6(NC) USB3.12(TMDS_Clock-)
HDMI_TXC_P: U5.33(TXC+) U13.4(D2+) U13.7(NC) USB3.10(TMDS_Clock+)
NetR20_1: R20.1 U16.1

Not connected (* = marked no-connect by the designer): U5 46(SPDIF_OUT); U16 2; USB3 14(Reserved_(N.C.))

### Library data of the parts
C15-C32 = C: as C49 on sheet 01_Power; 联系售后: https://shop463601444.taobao.com
R13 = R: 贴片电阻1%; BOM名称: 贴片电阻; 版权归属: 来自淘宝 ID：黄晶宝石; 联系售后: https://shop463601444.taobao.com
R14-R21 = R: 贴片电阻; 版权归属: 来自淘宝 ID：黄晶宝石; BOM名称: 贴片电阻; 联系售后: https://shop463601444.taobao.com
U5 = adv7511kstz: 接口类型:I2S；I2C;数据速率:-;; Manufacturer: ADI(亚德诺); AddInBom: yes; ModelId: 469e6cc70557486dbd01fd12ff814964; ModelName: LQFP-100_L14.0-W14.0-H1.4-LS16.0-P0.50; ModelTransform: 629.92,629.92,0,0,0,0,0,0,0; Voltage - Supply: 1.8V~3.3V; Symbol: ADV7511KSTZ; LCSC Part Name: 225 MHz, 高性能HDMI发射器带ARC; SupplierPart: C179459; ManufacturerPart: ADV7511KSTZ; Supplier Footprint: LQFP-100(14x14); JLCPCB Part Class: Extended Part; Datasheet: https://item.szlcsc.com/datasheet/ADV7511KSTZ/190853.html; Supplier: LCSC; ConvertToPcb: yes; FootprintName: LQFP-100_L14.0-W14.0-P0.50-LS16.0-BL; Interface: I2S；I2C; Data Rate: -; Operating Temperature: 0℃~+70℃; Supply Current: -; Quiescent Supply Current: -; Features: 中断生成
U12-U14 = TPD4E05U06: TVS 5V ESD
U15 = TPD1E05U06: 单通道ESD
U16 = BAS40LT1G: 肖特基二极管
USB3 = hdmi-001s: as USB1 on sheet 02_ADV7611_HDMI_IN; Symbol: HDMI-001S; LCSC Part Name: HDMI-A 母 19P; SupplierPart: C720616; ManufacturerPart: HDMI-001S; Supplier Footprint: SMD; JLCPCB Part Class: Extended Part; Datasheet: https://item.szlcsc.com/datasheet/HDMI-001S/763623.html; Supplier: LCSC; ConvertToPcb: yes; FootprintName: HDMI-SMD_HDMI-001S; ModelName: HDMI-SMD_HDMI-001S; Number of Pins: 19P; Mounting Type: 卧贴; Current Rating: -; Voltage Rating: -; Operating Temperature: -
X2 = ot322512mjba4sl: 频率:12MHz;常温频差:±10ppm;输出模式:CMOS;工作电压:1.8V~3.3V;频率稳定度:±20ppm;; Manufacturer: YXC(扬兴晶振); AddInBom: yes; ModelId: ae22b8d143894765bc8100c37cb6356f; ModelName: OSC-SMD_4P-L3.2-W2.5-H1.0; ModelTransform: 125.984,98.425,0,0,0,0,0,0,0; Value: 12MHz; Normal temperature Frequency Tolerance: ±10ppm; Output Type: CMOS; Frequency Stability: ±20ppm; Symbol: OT322512MJBA4SL; LCSC Part Name: YSO110TR 12MHZ 1.8V-3.3V ±10PPM -40~85℃ (±20PPM) CMOS; SupplierPart: C725989; ManufacturerPart: OT322512MJBA4SL; Supplier Footprint: SMD3225-4P; JLCPCB Part Class: Extended Part; Datasheet: https://item.szlcsc.com/datasheet/OT322512MJBA4SL/772573.html; Supplier: LCSC; ConvertToPcb: yes; FootprintName: OSC-SMD_4P-L3.2-W2.5-BL; Voltage - Supply: 1.8V~3.3V; Operating Temperature: -40℃~+85℃

## Nets that join several sheets
1V8: 04_OV5640 (22 pins), 05_FPGA_Interface (CN1.57 CN1.58 JP3.3), 02_ADV7611_HDMI_IN (29 pins), 03_ADV7511_HDMI_OUT (31 pins)
3V3: 01_Power (C51.2 L1.1 U17.4 U17.6), 04_OV5640 (24 pins), 05_FPGA_Interface (CN1.61 CN1.62 JP3.2), 02_ADV7611_HDMI_IN (29 pins), 03_ADV7511_HDMI_OUT (C29.1 C30.1 R20.2 U5.47)
GND: 01_Power (6 pins), 04_OV5640 (70 pins), 05_FPGA_Interface (17 pins), 02_ADV7611_HDMI_IN (84 pins), 03_ADV7511_HDMI_OUT (78 pins)
ADV_RX_DE_1V8: 05_FPGA_Interface (CN1.49), 02_ADV7611_HDMI_IN (U2.38)
ADV_RX_HS_1V8: 05_FPGA_Interface (CN1.51), 02_ADV7611_HDMI_IN (U2.40)
ADV_RX_INT1_1V8: 05_FPGA_Interface (CN1.5), 02_ADV7611_HDMI_IN (U11.9)
ADV_RX_LLC_1V8: 05_FPGA_Interface (CN1.22), 02_ADV7611_HDMI_IN (U1.37)
ADV_RX_P0_1V8: 05_FPGA_Interface (CN1.47), 02_ADV7611_HDMI_IN (U2.37)
ADV_RX_P1_1V8: 05_FPGA_Interface (CN1.45), 02_ADV7611_HDMI_IN (U2.36)
ADV_RX_P2_1V8: 05_FPGA_Interface (CN1.52), 02_ADV7611_HDMI_IN (U2.35)
ADV_RX_P3_1V8: 05_FPGA_Interface (CN1.50), 02_ADV7611_HDMI_IN (U2.33)
ADV_RX_P4_1V8: 05_FPGA_Interface (CN1.48), 02_ADV7611_HDMI_IN (U2.32)
ADV_RX_P5_1V8: 05_FPGA_Interface (CN1.46), 02_ADV7611_HDMI_IN (U2.30)
ADV_RX_P6_1V8: 05_FPGA_Interface (CN1.44), 02_ADV7611_HDMI_IN (U2.29)
ADV_RX_P7_1V8: 05_FPGA_Interface (CN1.42), 02_ADV7611_HDMI_IN (U2.27)
ADV_RX_P8_1V8: 05_FPGA_Interface (CN1.40), 02_ADV7611_HDMI_IN (U2.26)
ADV_RX_P9_1V8: 05_FPGA_Interface (CN1.36), 02_ADV7611_HDMI_IN (U1.47)
ADV_RX_P10_1V8: 05_FPGA_Interface (CN1.34), 02_ADV7611_HDMI_IN (U1.46)
ADV_RX_P11_1V8: 05_FPGA_Interface (CN1.32), 02_ADV7611_HDMI_IN (U1.44)
ADV_RX_P12_1V8: 05_FPGA_Interface (CN1.30), 02_ADV7611_HDMI_IN (U1.43)
ADV_RX_P13_1V8: 05_FPGA_Interface (CN1.28), 02_ADV7611_HDMI_IN (U1.41)
ADV_RX_P14_1V8: 05_FPGA_Interface (CN1.26), 02_ADV7611_HDMI_IN (U1.40)
ADV_RX_P15_1V8: 05_FPGA_Interface (CN1.24), 02_ADV7611_HDMI_IN (U1.38)
ADV_RX_P16_1V8: 05_FPGA_Interface (CN1.18), 02_ADV7611_HDMI_IN (U1.36)
ADV_RX_P17_1V8: 05_FPGA_Interface (CN1.16), 02_ADV7611_HDMI_IN (U1.35)
ADV_RX_P18_1V8: 05_FPGA_Interface (CN1.14), 02_ADV7611_HDMI_IN (U1.33)
ADV_RX_P19_1V8: 05_FPGA_Interface (CN1.12), 02_ADV7611_HDMI_IN (U1.32)
ADV_RX_P20_1V8: 05_FPGA_Interface (CN1.10), 02_ADV7611_HDMI_IN (U1.30)
ADV_RX_P21_1V8: 05_FPGA_Interface (CN1.8), 02_ADV7611_HDMI_IN (U1.29)
ADV_RX_P22_1V8: 05_FPGA_Interface (CN1.6), 02_ADV7611_HDMI_IN (U1.27)
ADV_RX_P23_1V8: 05_FPGA_Interface (CN1.4), 02_ADV7611_HDMI_IN (U1.26)
ADV_RX_RESETN_1V8: 05_FPGA_Interface (CN1.3), 02_ADV7611_HDMI_IN (U11.8)
ADV_RX_SCL_1V8: 05_FPGA_Interface (CN1.9), 02_ADV7611_HDMI_IN (R5.1 U3.4)
ADV_RX_SDA_1V8: 05_FPGA_Interface (CN1.7), 02_ADV7611_HDMI_IN (R3.1 U3.3)
ADV_RX_VS_ALSB_1V8: 05_FPGA_Interface (CN1.53), 02_ADV7611_HDMI_IN (U2.41)
ADV_TX_D4: 05_FPGA_Interface (CN1.110), 03_ADV7511_HDMI_OUT (U5.92)
ADV_TX_D5: 05_FPGA_Interface (CN1.108), 03_ADV7511_HDMI_OUT (U5.91)
ADV_TX_D6: 05_FPGA_Interface (CN1.106), 03_ADV7511_HDMI_OUT (U5.90)
ADV_TX_D7: 05_FPGA_Interface (CN1.104), 03_ADV7511_HDMI_OUT (U5.89)
ADV_TX_D8: 05_FPGA_Interface (CN1.100), 03_ADV7511_HDMI_OUT (U5.88)
ADV_TX_D9: 05_FPGA_Interface (CN1.98), 03_ADV7511_HDMI_OUT (U5.87)
ADV_TX_D10: 05_FPGA_Interface (CN1.96), 03_ADV7511_HDMI_OUT (U5.86)
ADV_TX_D11: 05_FPGA_Interface (CN1.94), 03_ADV7511_HDMI_OUT (U5.85)
ADV_TX_D16: 05_FPGA_Interface (CN1.92), 03_ADV7511_HDMI_OUT (U5.80)
ADV_TX_D17: 05_FPGA_Interface (CN1.88), 03_ADV7511_HDMI_OUT (U5.78)
ADV_TX_D18: 05_FPGA_Interface (CN1.116), 03_ADV7511_HDMI_OUT (U5.74)
ADV_TX_D19: 05_FPGA_Interface (CN1.91), 03_ADV7511_HDMI_OUT (U5.73)
ADV_TX_D20: 05_FPGA_Interface (CN1.93), 03_ADV7511_HDMI_OUT (U5.72)
ADV_TX_D21: 05_FPGA_Interface (CN1.95), 03_ADV7511_HDMI_OUT (U5.71)
ADV_TX_D22: 05_FPGA_Interface (CN1.97), 03_ADV7511_HDMI_OUT (U5.70)
ADV_TX_D23: 05_FPGA_Interface (CN1.99), 03_ADV7511_HDMI_OUT (U5.69)
ADV_TX_D28: 05_FPGA_Interface (CN1.103), 03_ADV7511_HDMI_OUT (U5.64)
ADV_TX_D29: 05_FPGA_Interface (CN1.105), 03_ADV7511_HDMI_OUT (U5.63)
ADV_TX_D30: 05_FPGA_Interface (CN1.107), 03_ADV7511_HDMI_OUT (U5.62)
ADV_TX_D31: 05_FPGA_Interface (CN1.109), 03_ADV7511_HDMI_OUT (U5.61)
ADV_TX_D32: 05_FPGA_Interface (CN1.111), 03_ADV7511_HDMI_OUT (U5.60)
ADV_TX_D33: 05_FPGA_Interface (CN1.113), 03_ADV7511_HDMI_OUT (U5.59)
ADV_TX_D34: 05_FPGA_Interface (CN1.115), 03_ADV7511_HDMI_OUT (U5.58)
ADV_TX_D35: 05_FPGA_Interface (CN1.117), 03_ADV7511_HDMI_OUT (U5.57)
ADV_TX_DE: 05_FPGA_Interface (CN1.112), 03_ADV7511_HDMI_OUT (U5.97)
ADV_TX_HS: 05_FPGA_Interface (CN1.114), 03_ADV7511_HDMI_OUT (U5.98)
ADV_TX_PCLK: 05_FPGA_Interface (CN1.90), 03_ADV7511_HDMI_OUT (U5.79)
ADV_TX_SCL: 05_FPGA_Interface (CN1.82), 03_ADV7511_HDMI_OUT (R21.1 U5.55)
ADV_TX_SDA: 05_FPGA_Interface (CN1.86), 03_ADV7511_HDMI_OUT (R19.1 U5.56)
ADV_TX_VS: 05_FPGA_Interface (CN1.118), 03_ADV7511_HDMI_OUT (U5.2)
CAM1_D0_1V8: 04_OV5640 (U18.37), 05_FPGA_Interface (CN1.85)
CAM1_D1_1V8: 04_OV5640 (U18.35), 05_FPGA_Interface (CN1.79)
CAM1_D2_1V8: 04_OV5640 (U18.36), 05_FPGA_Interface (CN1.81)
CAM1_D3_1V8: 04_OV5640 (U18.32), 05_FPGA_Interface (CN1.75)
CAM1_D4_1V8: 04_OV5640 (U18.33), 05_FPGA_Interface (CN1.77)
CAM1_D5_1V8: 04_OV5640 (U18.29), 05_FPGA_Interface (CN1.71)
CAM1_D6_1V8: 04_OV5640 (U18.30), 05_FPGA_Interface (CN1.73)
CAM1_D7_1V8: 04_OV5640 (U18.26), 05_FPGA_Interface (CN1.67)
CAM1_HREF_1V8: 04_OV5640 (U18.38), 05_FPGA_Interface (CN1.87)
CAM1_PCLK_1V8: 04_OV5640 (U18.27), 05_FPGA_Interface (CN1.69)
CAM1_PWDN_1V8: 04_OV5640 (U20.9), 05_FPGA_Interface (CN1.76)
CAM1_RST_1V8: 04_OV5640 (U20.8), 05_FPGA_Interface (CN1.74)
CAM1_SCL_1V8: 04_OV5640 (R33.2 U23.4), 05_FPGA_Interface (CN1.80)
CAM1_SDA_1V8: 04_OV5640 (R31.2 U23.3), 05_FPGA_Interface (CN1.78)
CAM1_VS_1V8: 04_OV5640 (U18.40), 05_FPGA_Interface (CN1.89)
CAM2_D0_1V8: 04_OV5640 (U19.44), 05_FPGA_Interface (CN1.29)
CAM2_D1_1V8: 04_OV5640 (U19.43), 05_FPGA_Interface (CN1.27)
CAM2_D2_1V8: 04_OV5640 (U19.41), 05_FPGA_Interface (CN1.25)
CAM2_D3_1V8: 04_OV5640 (U19.40), 05_FPGA_Interface (CN1.23)
CAM2_D4_1V8: 04_OV5640 (U19.38), 05_FPGA_Interface (CN1.21)
CAM2_D5_1V8: 04_OV5640 (U19.37), 05_FPGA_Interface (CN1.17)
CAM2_D6_1V8: 04_OV5640 (U19.36), 05_FPGA_Interface (CN1.15)
CAM2_D7_1V8: 04_OV5640 (U19.35), 05_FPGA_Interface (CN1.13)
CAM2_HREF_1V8: 04_OV5640 (U19.46), 05_FPGA_Interface (CN1.31)
CAM2_PCLK_1V8: 04_OV5640 (U19.33), 05_FPGA_Interface (CN1.11)
CAM2_PWDN_1V8: 04_OV5640 (U22.9), 05_FPGA_Interface (CN1.41)
CAM2_RST_1V8: 04_OV5640 (U22.8), 05_FPGA_Interface (CN1.43)
CAM2_SCL_1V8: 04_OV5640 (R28.2 U21.4), 05_FPGA_Interface (CN1.39)
CAM2_SDA_1V8: 04_OV5640 (R26.2 U21.3), 05_FPGA_Interface (CN1.35)
CAM2_VS_1v8: 04_OV5640 (U19.47), 05_FPGA_Interface (CN1.33)
HDMI_TX_5V: 01_Power (C49.2 C50.2 R22.1 U17.2), 03_ADV7511_HDMI_OUT (6 pins)